# Altium schematic sheet 01-Top.SchDoc
size Letter
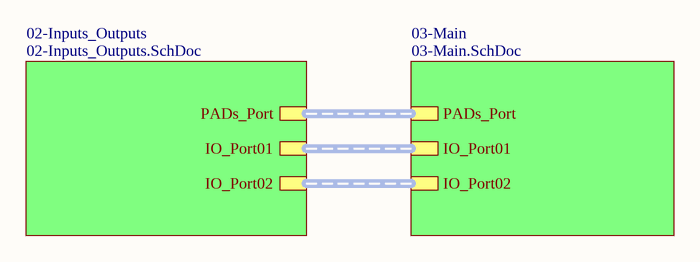
[diagram p0: 01-Top.SchDoc]

## Sub-sheets
02-Inputs_Outputs = 02-Inputs_Outputs.SchDoc: IO_Port01 (harness IO_Port01_Harness), IO_Port02 (harness IO_Port02_Harness), PADs_Port (harness PADs_Harness)
03-Main = 03-Main.SchDoc: PADs_Port (harness PADs_Harness), IO_Port02 (harness IO_Port02_Harness), IO_Port01 (harness IO_Port01_Harness)

## Buses and harness runs
harness sheet 02-Inputs_Outputs/IO_Port01 = sheet 03-Main/IO_Port01
harness sheet 02-Inputs_Outputs/IO_Port02 = sheet 03-Main/IO_Port02
harness sheet 02-Inputs_Outputs/PADs_Port = sheet 03-Main/PADs_Port